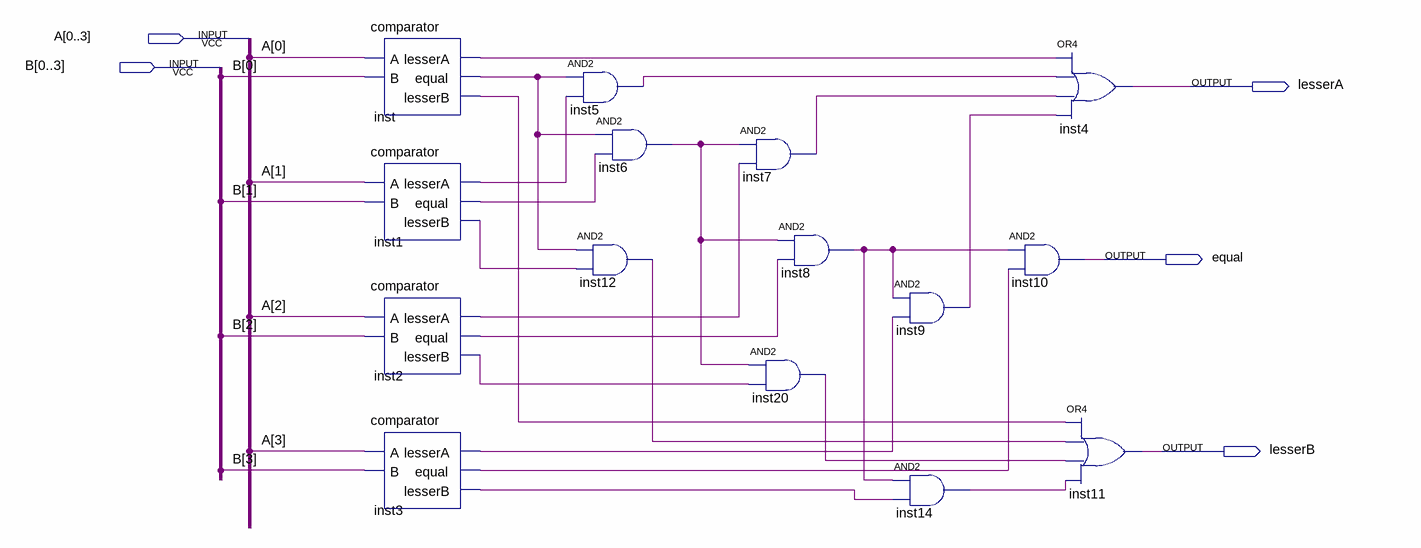
[diagram p0: schematic sheet]
// Quartus schematic FourBitComparator.bdf as structural Verilog: 15 symbols, 5 pins
module FourBitComparator (
  input  [0:3] A,
  input  [0:3] B,
  output lesserA,
  output equal,
  output lesserB
);

  wire inst1_equal, inst1_lessera, inst1_lesserb, inst2_equal, inst2_lessera, inst2_lesserb, inst3_equal,
       inst3_lessera, inst3_lesserb, inst5_out, inst6_out, inst7_out, inst8_out, inst9_out, inst12_out,
       inst14_out, inst20_out, inst_equal, inst_lessera, inst_lesserb;

  comparator inst (.A(A[0]), .B(B[0]), .lesserA(inst_lessera), .equal(inst_equal), .lesserB(inst_lesserb));
  comparator inst1 (.A(A[1]), .B(B[1]), .lesserA(inst1_lessera), .equal(inst1_equal), .lesserB(inst1_lesserb));
  comparator inst2 (.A(A[2]), .B(B[2]), .lesserA(inst2_lessera), .equal(inst2_equal), .lesserB(inst2_lesserb));
  comparator inst3 (.A(A[3]), .B(B[3]), .lesserA(inst3_lessera), .equal(inst3_equal), .lesserB(inst3_lesserb));
  and inst5 (inst5_out, inst_equal, inst1_lessera);
  and inst6 (inst6_out, inst_equal, inst1_equal);
  and inst12 (inst12_out, inst_equal, inst1_lesserb);
  and inst7 (inst7_out, inst6_out, inst2_lessera);
  and inst20 (inst20_out, inst6_out, inst2_lesserb);
  and inst8 (inst8_out, inst6_out, inst2_equal);
  and inst9 (inst9_out, inst8_out, inst3_lessera);
  and inst14 (inst14_out, inst8_out, inst3_lesserb);
  or inst4 (lesserA, inst_lessera, inst5_out, inst7_out, inst9_out);
  and inst10 (equal, inst8_out, inst3_equal);
  or inst11 (lesserB, inst_lesserb, inst12_out, inst20_out, inst14_out);
endmodule
